# Altium schematic sheet 06-multimodal-analogfrontend.SchDoc
size A4; CompanyName: ICAS Lab.; DrawnBy: Isil Isiksalan; SheetNumber: 2; SheetTotal: 9
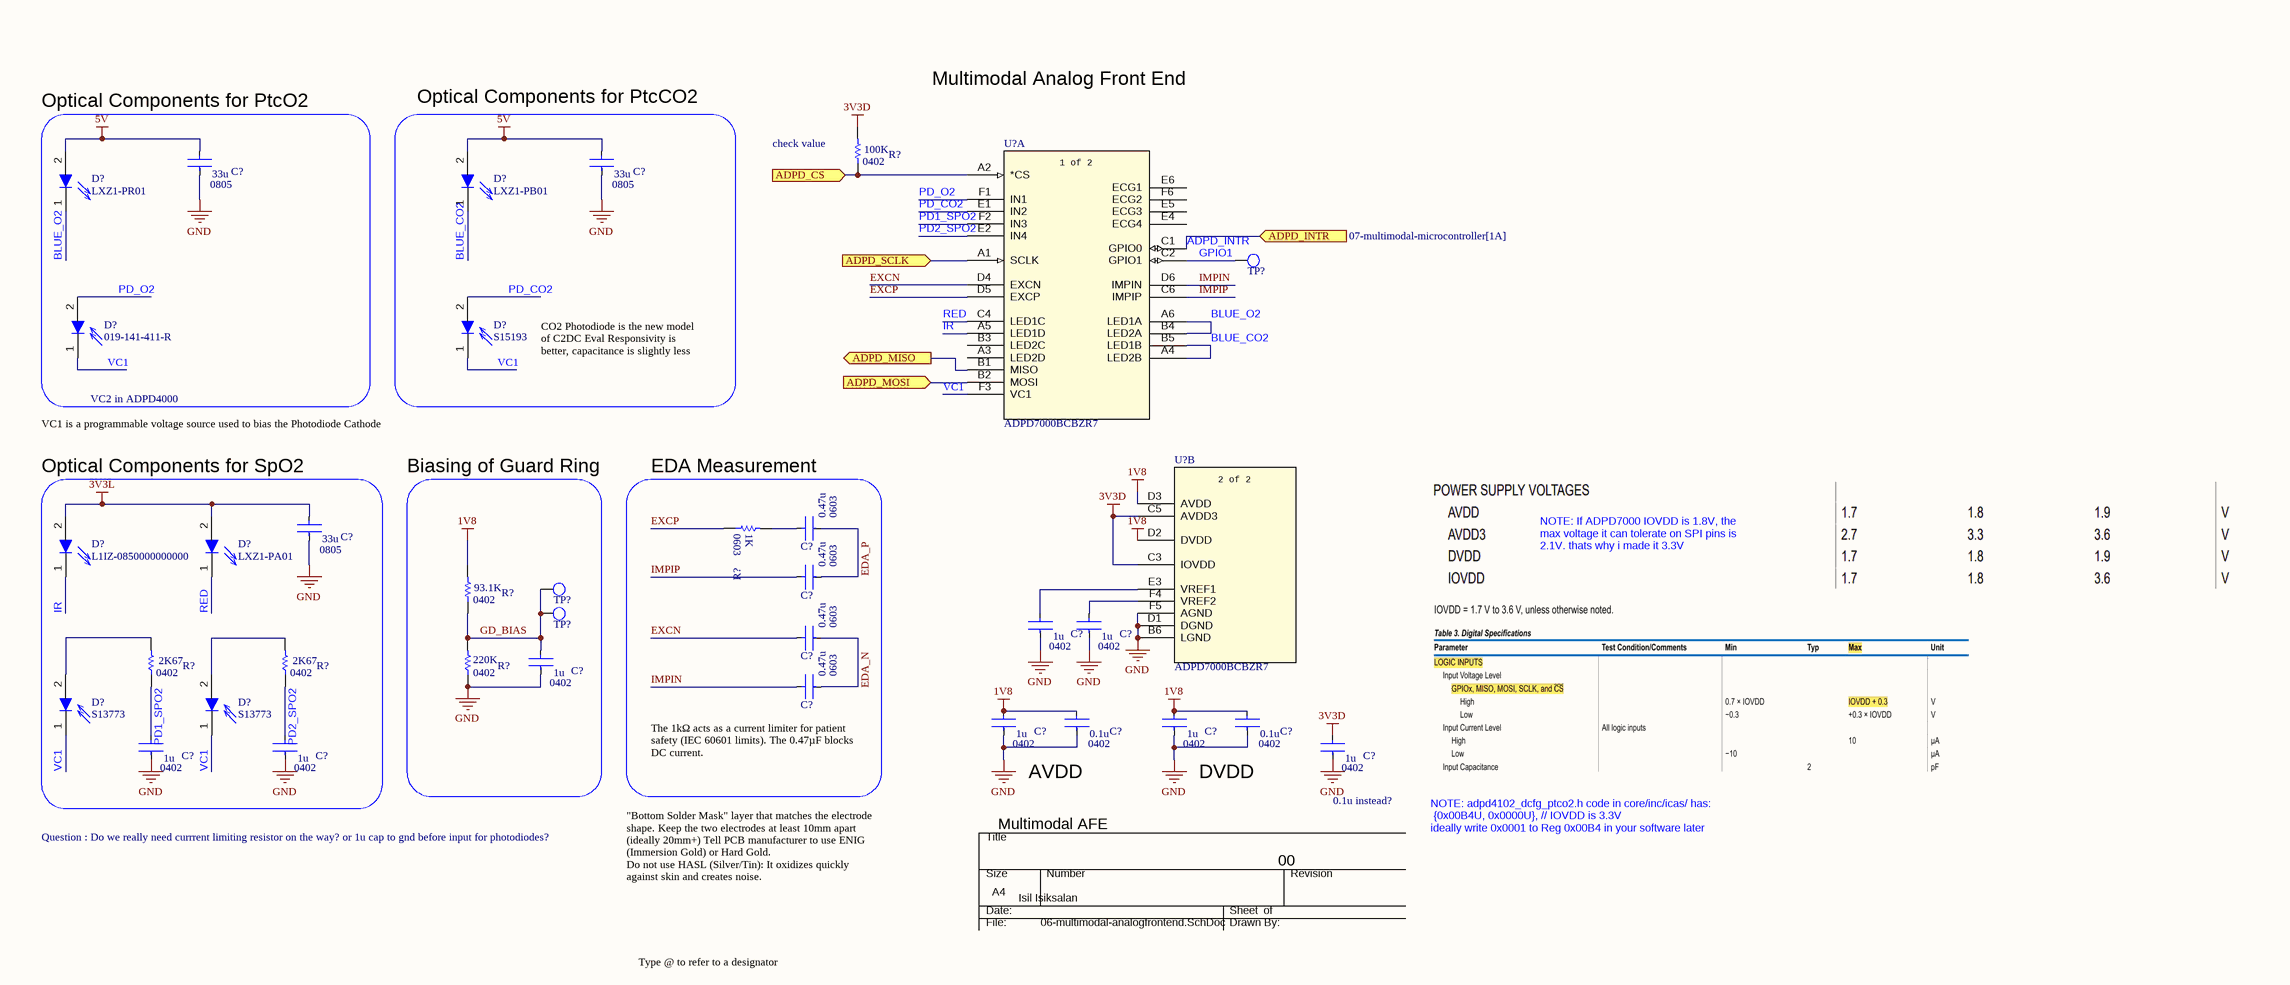
[diagram p0: 06-multimodal-analogfrontend.SchDoc]

## Parts
(Parts that share a designator on the sheet are numbered #1, #2 ... from top to bottom, then left to right.)
C?#1  C2012X5R1A336M125AC  [CAPTDK0805]  (value not drawn)
C?#2  C2012X5R1A336M125AC  [CAPTDK0805]  (value not drawn)
C?#3  C2012X5R1A336M125AC  [CAPTDK0805]  (value not drawn)
C?#4  CL10B474KA8NFNC  [CAPTDK0603]  (value not drawn)
C?#5  CL10B474KA8NFNC  [CAPTDK0603]  (value not drawn)
C?#6  C1005X5R1V105K050BC  [CAPTDK0402]  (value not drawn)
C?#7  C1005X5R1V105K050BC  [CAPTDK0402]  (value not drawn)
C?#8  CL10B474KA8NFNC  [CAPTDK0603]  (value not drawn)
C?#9  C1005X5R1V105K050BC  [CAPTDK0402]  (value not drawn)
C?#10  CL10B474KA8NFNC  [CAPTDK0603]  (value not drawn)
C?#11  C1005X5R1V105K050BC  [CAPTDK0402]  (value not drawn)
C?#12  C1005X7R1H104K050BB  [CAPTDK0402]  (value not drawn)
C?#13  C1005X5R1V105K050BC  [CAPTDK0402]  (value not drawn)
C?#14  C1005X7R1H104K050BB  [CAPTDK0402]  (value not drawn)
C?#15  C1005X5R1V105K050BC  [CAPTDK0402]  (value not drawn)
C?#16  C1005X5R1V105K050BC  [CAPTDK0402]  (value not drawn)
C?#17  C1005X5R1V105K050BC  [CAPTDK0402]  (value not drawn)
D?#1  LXZ1-PB01  [LXZ1]
D?#2  LXZ1-PR01  [LXZ1-PR01]
D?#3  S15193  [S15193]
D?#4  019-141-411-R  [RED-PD]
D?#5  LXZ1-PA01  [LXZ1-PA01]
D?#6  L1IZ-0850000000000  [L1IZ0850000000000]
D?#7  S13773  [S13773]
D?#8  S13773  [S13773]
R?#1  RMCF0402FT100K  [RES-STACK-POLE-0402]  (value not drawn)
R?#2  RMCF0603JT1K00  [RES-STACK-POLE-0603]  (value not drawn)
R?#3  RMCF0402FT93K1  [RES-STACK-POLE-0402]  (value not drawn)
R?#4  RMCF0402FT2K67  [RES-STACK-POLE-0402]  (value not drawn)
R?#5  RMCF0402FT2K67  [RES-STACK-POLE-0402]  (value not drawn)
R?#6  RMCF0402FT220K  [RES-STACK-POLE-0402]  (value not drawn)
TP?#1  TESTPOINT_S  [TESTPOINT_S]  (value not drawn)  (no BOM)
TP?#2  TESTPOINT_S  [TESTPOINT_S]  (value not drawn)  (no BOM)
TP?#3  TESTPOINT_S  [TESTPOINT_S]  (value not drawn)  (no BOM)
U?#1  ADPD7000BCBZR7  [CB-36-11_ADI]  (part A of 2)
U?#2  ADPD7000BCBZR7  [CB-36-11_ADI]  (part B of 2)

## Blocks framed on the sheet
VC2 in ADPD4000: C?#1 D?#2 D?#4

## Ports
ADPD_CS (in), ADPD_INTR (in, see 07-multimodal-microcontroller[1A]), ADPD_MISO (out), ADPD_MOSI (in), ADPD_SCLK (in)

## Nets
1V8: C?#11.1 C?#12.1 C?#13.1 C?#14.1 R?#3.2 U?#2.D2(DVDD) U?#2.D3(AVDD)
3V3D: C?#17.1 R?#1.2 U?#2.C3(IOVDD) U?#2.C5(AVDD3)
3V3L: C?#3.1 D?#5.2 D?#6.2
5V: C?#1.1 C?#2.1 D?#1.2 D?#2.2
GND: C?#1.2 C?#2.2 C?#3.2 C?#6.2 C?#7.2 C?#9.2 C?#11.2 C?#12.2 C?#13.2 C?#14.2 C?#15.2 C?#16.2 C?#17.2 R?#6.1 U?#2.B6(LGND) U?#2.D1(DGND) U?#2.F5(AGND)
ADPD_CS: R?#1.1 U?#1.A2(*CS) ; port ADPD_CS
ADPD_INTR: U?#1.C1(GPIO0) ; port ADPD_INTR
ADPD_MISO: U?#1.B1(MISO) ; port ADPD_MISO
ADPD_MOSI: U?#1.B2(MOSI) ; port ADPD_MOSI
ADPD_SCLK: U?#1.A1(SCLK) ; port ADPD_SCLK
BLUE_CO2: D?#1.1 U?#1.A4(LED2B) U?#1.B5(LED1B)
BLUE_O2: D?#2.1 U?#1.A6(LED1A) U?#1.B4(LED2A)
EDA_N: C?#8.2 C?#10.2
EDA_P: C?#4.2 C?#5.2
EXCN: C?#8.1 U?#1.D4(EXCN)
EXCP: R?#2.1 U?#1.D5(EXCP)
GD_BIAS: C?#9.1 R?#3.1 R?#6.2 TP?#2.1 TP?#3.1
GPIO1: TP?#1.1 U?#1.C2(GPIO1)
IMPIN: C?#10.1 U?#1.D6(IMPIN)
IMPIP: C?#5.1 U?#1.C6(IMPIP)
IR: D?#6.1 U?#1.A5(LED1D)
PD1_SPO2: C?#15.1 R?#4.1 U?#1.F2(IN3)
PD2_SPO2: C?#16.1 R?#5.1 U?#1.E2(IN4)
PD_CO2: D?#3.2 U?#1.E1(IN2)
PD_O2: D?#4.2 U?#1.F1(IN1)
RED: D?#5.1 U?#1.C4(LED1C)
VC1: D?#3.1 D?#4.1 D?#7.1 D?#8.1 U?#1.F3(VC1)
NetC?#4_1: C?#4.1 R?#2.2
NetC?#6_1: C?#6.1 U?#2.E3(VREF1)
NetC?#7_1: C?#7.1 U?#2.F4(VREF2)
NetD?#7_2: D?#7.2 R?#4.2
NetD?#8_2: D?#8.2 R?#5.2

Not connected (* = marked no-connect by the designer): U?#1 A3(LED2D) B3(LED2C) E4(ECG4) E5(ECG3) E6(ECG1) F6(ECG2)

## Notes on the sheet
- Multimodal Analog Front End
- Optical Components for PtcO2
- Optical Components for PtcCO2
- (near R?#1) check value
- CO2 Photodiode is the new model of C2DC Eval Responsivity is better, capacitance is slightly less
- VC1 is a programmable voltage source used to bias the Photodiode Cathode
- Optical Components for SpO2
- Biasing of Guard Ring
- EDA Measurement
- NOTE: If ADPD7000 IOVDD is 1.8V, the max voltage it can tolerate on SPI pins is 2.1V. thats why i made it 3.3V
- (near C?#10) The 1kΩ acts as a current limiter for patient safety (IEC 60601 limits). The 0.47µF blocks DC current.
- Multimodal AFE
- (near C?#12) AVDD
- (near C?#14) DVDD
- (near C?#17) 0.1u instead?
- Question : Do we really need currrent limiting resistor on the way? or 1u cap to gnd before input for photodiodes?
- "Bottom Solder Mask" layer that matches the electrode shape. Keep the two electrodes at least 10mm apart (ideally 20mm+) Tell PCB manufacturer to use ENIG (Immersion Gold) or Hard Gold.
  Do not use HASL (Silver/Tin): It oxidizes quickly against skin and creates noise.
- 00
- NOTE: adpd4102_dcfg_ptco2.h code in core/inc/icas/ has:
  {0x00B4U, 0x0000U}, // IOVDD is 3.3V
  ideally write 0x0001 to Reg 0x00B4 in your software later
- Type @ to refer to a designator
- THIS DOCUMENT AND THE DATA DISCLOSED HEREIN OR
- HEREWITH IS THE PROPERTY OF ALTIUM LIMITED AND MAY
- DWG NO:
- REVISION
- REV:
- DESCRIPTION
- DATE
- APPROVED
- BE FREELY DISTRIBUTED IN WHOLE. NO RIGHTS ARE
- RESERVED OR EXPRESS OR IMPLIED WARANTEE GIVEN.
- ENG:
- APPROVALS
- PROJECT
- DSN:
- CHK:
- REFERENCE DOCUMENTS
- PROJECT REVISION:
- TITLE
- DOCUMENT REVISION:
- DESIGN ITEM:
- BOM:
- FAB DWG:
- PCB DWG:
- ASSY DWG:
- SCALE:
- A3
- SIZE
- CAGE CODE
- FILE NAME
- DWG NO.
- SHEET
- OF
- REV
- (in symbol ADPD7000BCBZR7, part A) 1 of 2
- (in symbol ADPD7000BCBZR7, part B) 2 of 2
- (in symbol C1005X5R1V105K050BC) 1u; 0402
- (in symbol C1005X7R1H104K050BB) 0.1u; 0402
- (in symbol C2012X5R1A336M125AC) 33u; 0805
- (in symbol CL10B474KA8NFNC) 0.47u; 0603
- (in symbol RMCF0402FT2K67) 2K67
- (in symbol RMCF0402FT93K1) 93.1K; 0402
- (in symbol RMCF0402FT100K) 100K; 0402
- (in symbol RMCF0402FT220K) 220K; 0402
- (in symbol RMCF0603JT1K00) 0603; 1K

## Library data of the parts
C?#1-C?#3 = C2012X5R1A336M125AC: CAP CER 33UF 10V X5R 0805; Supplier 1: Digi-Key; Supplier Part Number 1: 445-8238-1-ND
C?#4 C?#5 C?#8 C?#10 = CL10B474KA8NFNC: 0.47 µF ±10% 25V Ceramic Capacitor X7R 0603 (1608 Metric); Supplier 1: DigiKey; Supplier Part Number 1: 1276-2082-1-ND
C?#6 C?#7 C?#9 C?#11 C?#13 C?#15-C?#17 = C1005X5R1V105K050BC: CAP CER 1UF 35V X5R 0402; Supplier 1: Digi-Key; Supplier Part Number 1: 445-9073-1-ND
C?#12 C?#14 = C1005X7R1H104K050BB: CAP CER 0.1UF 50V X7R 0402; Supplier 1: Digi-Key; Supplier Part Number 1: 445-5932-1-ND
D?#1 = LXZ1-PB01: LED BLUE 470NM SMD 0705; Mfr_Name: Lumileds; Type: DEV; Copyright: Copyright (C) 2022 Ultra Librarian. All rights reserved.; Manufacturer_Part_Number: LXZ1-PB01; Digi-Key_Part_Number_3: 1416-1051-6-ND; RefDes: RefDes; Supplier 1: DigiKey; Supplier Part Number 1: 1416-1052-1-ND
D?#2 = LXZ1-PR01: LED LUXEON Z RYL BLUE 450NM 2SMD; Manufacturer: Philips Lumileds; Wavelength: 447.5nm; Forward Current: 500mA; Viewing Angle: 125°; Number of LEDs: 1; Forward Voltage: 2.9V; Lens Style: Rectangular,Round; Supplier 1: Digi-Key; Manufacturer Part Number: LXZ1-PR01; RoHS: Yes; Category: LEDs; Stock 1: 4609; Pricing 1: 1=2.57000, 10=1.71400, 100=1.31940, 500=1.19264, 1000=1.16469 (USD); Mount: Surface Mount; Case/Package: SMD/SMT; Number of Pins: 2; Color: Blue; Lens Color: Blue; Min Operating Temperature: -40°C; Max Operating Temperature: 135°C; Dominant Wavelength: 447.5nm; Test Current: 500mA; Illumination Color: Blue; Packaging: Tape and Reel; Package Quantity: 2000; Length: 1.7mm; Width: 1.3mm; Height: 0.66mm; Lead Free: Lead Free; ComponentLink1URL: https://datasheet.ciiva.com/25632/0900766b81251f28-25632625.pdf?src-supplier=RSComponents; ComponentLink1Description: https://datasheet.ciiva.com/25632/0900766b81251f28-25632625.pdf?src-supplier=RSComponents; ComponentLink2URL: https://datasheet.ciiva.com/16345/ds105-16345515.pdf?src-supplier=Future+Electronics; ComponentLink2Description: https://datasheet.ciiva.com/16345/ds105-16345515.pdf?src-supplier=Future+Electronics; Supplier Part Number 1: 1416-1058-1-ND
D?#3 = S15193: PHOTODIODE PIN 380 NM-1000 NM 20V 0.64 A/W SMD; Manufacturer: Hamamatsu; ComponentLink1Description: Datasheet; ComponentLink1URL: https://www.hamamatsu.com/resources/pdf/ssd/s13773_kpin1088e.pdf; Manufacturer Part Number: S15193; Supplier 1: Hamamatsu; Supplier 1 Part Number: S15193
D?#4 = 019-141-411-R: PHOTODIODE RED MICRO SMT; Supplier 1: Digi-Key; Supplier Part Number 1: 209-019-141-411-RCT-ND
D?#5 = LXZ1-PA01: LED LUXEON Z RED 660NM SMD; Mfr_Name: Lumileds; Type: DEV; Copyright: Copyright (C) 2022 Ultra Librarian. All rights reserved.; Manufacturer_Part_Number: LXZ1-PA01; Digi-Key_Part_Number_1: 1416-1051-1-ND; Digi-Key_Part_Number_2: 1416-1051-2-ND; Digi-Key_Part_Number_3: 1416-1051-6-ND; RefDes: RefDes; Supplier 1: Digi-Key; Supplier Part Number 1: 1416-1051-1-ND
D?#6 = L1IZ-0850000000000: LED INFRARED SMD 850 NM; Manufacturer_Name: Lumileds; Datasheet Link: https://www.lumileds.com/uploads/682/DS190-pdf; Height: 1mm; Manufacturer_Part_Number: L1IZ-0850000000000; Mouser Part Number: 997-L1IZ-085000000; Mouser Price/Stock: https://www.mouser.co.uk/ProductDetail/Lumileds/L1IZ-0850000000000/?qs=5aG0NVq1C4zF5FvmYgealQ%3D%3D; Arrow Part Number: L1IZ-0850000000000; Arrow Price/Stock: https://www.arrow.com/en/products/l1iz-0850000000000/lumileds; Supplier 1: Digi-Key; Supplier Part Number 1: 1416-1997-1-ND
D?#7 D?#8 = S13773: PHOTODIODE PIN 380 NM-1000 NM 20V 0.54 A/W SMD; Manufacturer: Hamamatsu; ComponentLink1Description: Datasheet; ComponentLink1URL: https://www.hamamatsu.com/resources/pdf/ssd/s13773_kpin1088e.pdf; Manufacturer Part Number: S13773; Supplier 1: Hamamatsu; Supplier 1 Part Number: S13773
R?#1 = RMCF0402FT100K: RES 100K OHM 1% 1/16W 0402; Supplier 1: Digi-Key; Supplier Part Number 1: RMCF0402FT100KCT-ND
R?#2 = RMCF0603JT1K00: 1 kOhms ±5% 0.1W, 1/10W Chip Resistor 0603 (1608 Metric) Automotive AEC-Q200 Thick Film; Supplier 1: DigiKey; Supplier Part Number 1: RMCF0603JT1K00CT-ND
R?#3 = RMCF0402FT93K1: RES 93.1K OHM 1% 1/16W 0402; Mfr_Name: Stackpole International; Manufacturer_Part_Number: RMCF0603FT80K6; Copyright: Copyright (C) 2022 Ultra Librarian. All rights reserved.; Digi-Key_Part_Number_1: RMCF0603FT80K6CT-ND; Digi-Key_Part_Number_2: RMCF0603FT80K6DKR-ND; Digi-Key_Part_Number_3: RMCF0603FT80K6TR-ND; RefDes: RefDes; Type: DEV; Supplier 1: Digi-Key; Supplier Part Number 1: RMCF0402FT93K1CT-ND
R?#4 R?#5 = RMCF0402FT2K67: RES 2.67K OHM 1% 1/16W 0402; Manufacturer: Stackpole Electronics; Rated Power Dissipation (P): 63mW; Rated Temperature: 70°C; Resistance: 2.67kR; Temperature Coefficient: 100ppm/°C; Working Voltage: 50V; Package Height: 0.3mm; Package Length: 1mm; Package Width: 0.5mm; Reference Standard: AEC-Q200; Supplier 1: Digikey; Manufacturer Part Number: RMCF0402FT2K67; RoHS: Yes; Category: Chip SMD Resistors; Stock 1: 61933; Pricing 1: 1=0.1, 10=0.021, 50=0.0116, 100=0.0093, 500=0.00594, 1000=0.005, 5000=0.00345 (USD); Mount: Surface Mount; Number of Pins: 2; Package Shape: Rectangular; Size Code: 0402; Terminal Finish: Nickel; Min Operating Temperature: -55°C; Max Operating Temperature: 155°C; Tolerance: 1%; JESD-609 Code: e3; Resistor Type: FIXED RESISTOR; Construction: Rectangular; Package Style: SMTMeter; Packaging: Tape and Reel; Technology: METAL GLAZE/THICK FILM; Termination: Wraparound; Reach SVHC Compliant: Yes; RoHS Compliant: Yes; ComponentLink1URL: https://datasheet.ciiva.com:443/pdfs/VipMasterIC/IC/SEIE/SEIE-S-A0009541969/SEIE-S-A0009541969-1.pdf?src-supplier=IHS+Markit; ComponentLink1Description: https://datasheet.ciiva.com:443/pdfs/VipMasterIC/IC/SEIE/SEIE-S-A0009541969/SEIE-S-A0009541969-1.pdf?src-supplier=IHS+Markit; ComponentLink2URL: https://www.seielect.com/Catalog/SEI-RMCF_RMCP.pdf?src-supplier=Digikey; ComponentLink2Description: https://www.seielect.com/Catalog/SEI-RMCF_RMCP.pdf?src-supplier=Digikey; ComponentLink3URL: https://www.seielect.com/catalog/SEI-Packaging.pdf?src-supplier=Digikey; ComponentLink3Description: https://www.seielect.com/catalog/SEI-Packaging.pdf?src-supplier=Digikey; ComponentLink4URL: https://www.seielect.com/catalog/SEI-RMCF_RMCP.pdf?src-supplier=Avnet; ComponentLink4Description: https://www.seielect.com/catalog/SEI-RMCF_RMCP.pdf?src-supplier=Avnet; Supplier Part Number 1: RMCF0402FT2K67CT-ND
R?#6 = RMCF0402FT220K: RES 220K OHM 1% 1/16W 0402; Supplier 1: Digi-Key; Supplier Part Number 1: RMCF0402FT220KCT-ND
TP?#1-TP?#3 = TESTPOINT_S: Testpoint Surface Pad
U?#1 U?#2 = ADPD7000BCBZR7: Multimodal Sensor Front End; Manufacturer_Name: Analog Devices Inc; Type: Interface; Copyright: Copyright (C) 2026 Ultra Librarian. All rights reserved.; Manufacturer_Part_Number: ADPD7000BCBZR7; RefDes: RefDes